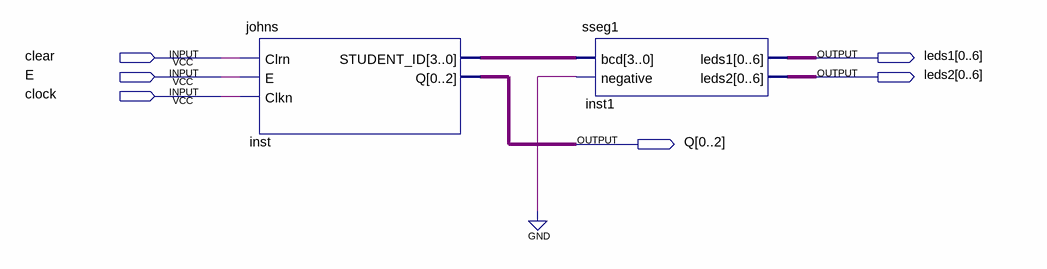
[diagram p0: schematic sheet]
// Quartus schematic johnsBlock.bdf as structural Verilog: 2 symbols, 6 pins
module johnsBlock (
  input  clear,
  input  E,
  input  clock,
  output [0:6] leds1,
  output [0:6] leds2,
  output [0:2] Q
);

  wire [3:0] inst_student_id;

  johns inst (.Clrn(clear), .E(E), .Clkn(clock), .STUDENT_ID(inst_student_id), .Q(Q));
  sseg1 inst1 (.bcd(inst_student_id), .negative(1'b0), .leds1(leds1), .leds2(leds2));
endmodule
